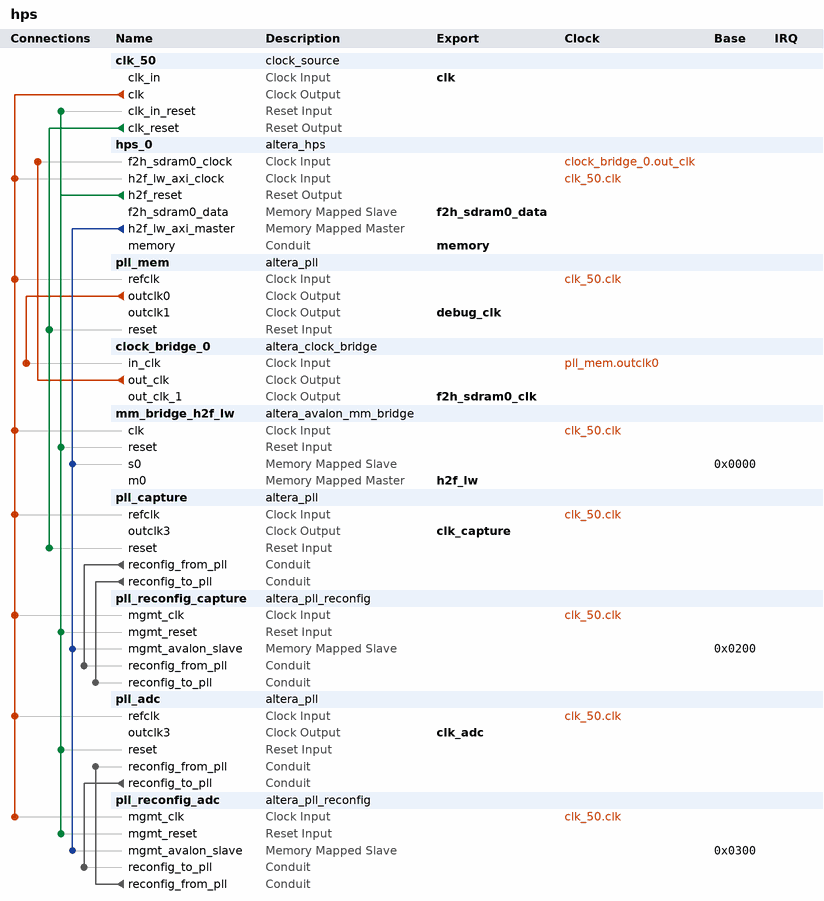
[diagram p0: system contents]
# Platform Designer (Qsys) system hps, Cyclone V 5CSEBA6U23I7
# Parameters at their usual value, and those the tool derives, are not listed.
package require -exact qsys 18.0
create_system hps
set_project_property DEVICE_FAMILY {Cyclone V}
set_project_property DEVICE 5CSEBA6U23I7

add_instance clk_50 clock_source 18.0
set_instance_parameter_value clk_50 clockFrequency 50000000

add_instance hps_0 altera_hps 18.0
set_instance_parameter_value hps_0 EMAC1_Mode N/A
set_instance_parameter_value hps_0 EMAC1_PinMuxing Unused
set_instance_parameter_value hps_0 F2SCLK_COLDRST_Enable false
set_instance_parameter_value hps_0 F2SCLK_DBGRST_Enable false
set_instance_parameter_value hps_0 F2SCLK_WARMRST_Enable false
set_instance_parameter_value hps_0 F2SDRAM_Type {Avalon-MM Bidirectional}
set_instance_parameter_value hps_0 F2SDRAM_Width 256
set_instance_parameter_value hps_0 F2SINTERRUPT_Enable false
set_instance_parameter_value hps_0 F2S_Width 0
set_instance_parameter_value hps_0 FPGA_PERIPHERAL_OUTPUT_CLOCK_FREQ_EMAC0_GTX_CLK 125
set_instance_parameter_value hps_0 FPGA_PERIPHERAL_OUTPUT_CLOCK_FREQ_EMAC0_MD_CLK 2.5
set_instance_parameter_value hps_0 FPGA_PERIPHERAL_OUTPUT_CLOCK_FREQ_EMAC1_GTX_CLK 125
set_instance_parameter_value hps_0 FPGA_PERIPHERAL_OUTPUT_CLOCK_FREQ_EMAC1_MD_CLK 2.5
set_instance_parameter_value hps_0 HPS_PROTOCOL DDR3
set_instance_parameter_value hps_0 I2C0_Mode N/A
set_instance_parameter_value hps_0 I2C0_PinMuxing Unused
set_instance_parameter_value hps_0 I2C1_Mode N/A
set_instance_parameter_value hps_0 I2C1_PinMuxing Unused
set_instance_parameter_value hps_0 LWH2F_Enable true
set_instance_parameter_value hps_0 MEM_BANKADDR_WIDTH 3
set_instance_parameter_value hps_0 MEM_CLK_FREQ 400.0
set_instance_parameter_value hps_0 MEM_COL_ADDR_WIDTH 10
set_instance_parameter_value hps_0 MEM_DQ_WIDTH 32
set_instance_parameter_value hps_0 MEM_DRV_STR RZQ/6
set_instance_parameter_value hps_0 MEM_ROW_ADDR_WIDTH 15
set_instance_parameter_value hps_0 MEM_RTT_NOM RZQ/6
set_instance_parameter_value hps_0 MEM_RTT_WR {Dynamic ODT off}
set_instance_parameter_value hps_0 MEM_TCL 7
set_instance_parameter_value hps_0 MEM_TFAW_NS 37.5
set_instance_parameter_value hps_0 MEM_TRAS_NS 35.0
set_instance_parameter_value hps_0 MEM_TRCD_NS 13.75
set_instance_parameter_value hps_0 MEM_TRFC_NS 300.0
set_instance_parameter_value hps_0 MEM_TRP_NS 13.75
set_instance_parameter_value hps_0 MEM_VENDOR Other
set_instance_parameter_value hps_0 MEM_WTCL 7
set_instance_parameter_value hps_0 QSPI_Mode N/A
set_instance_parameter_value hps_0 QSPI_PinMuxing Unused
set_instance_parameter_value hps_0 REF_CLK_FREQ 25.0
set_instance_parameter_value hps_0 S2FCLK_USER2CLK 5
set_instance_parameter_value hps_0 S2F_Width 0
set_instance_parameter_value hps_0 SDIO_Mode N/A
set_instance_parameter_value hps_0 SDIO_PinMuxing Unused
set_instance_parameter_value hps_0 SPIM1_Mode N/A
set_instance_parameter_value hps_0 SPIM1_PinMuxing Unused
set_instance_parameter_value hps_0 STM_Enable false
set_instance_parameter_value hps_0 TIMING_BOARD_AC_SKEW 0.02
set_instance_parameter_value hps_0 TIMING_BOARD_AC_TO_CK_SKEW 0.0
set_instance_parameter_value hps_0 TIMING_BOARD_DQ_TO_DQS_SKEW 0.0
set_instance_parameter_value hps_0 TIMING_BOARD_MAX_CK_DELAY 0.6
set_instance_parameter_value hps_0 TIMING_BOARD_MAX_DQS_DELAY 0.6
set_instance_parameter_value hps_0 TIMING_BOARD_SKEW_BETWEEN_DQS 0.02
set_instance_parameter_value hps_0 TIMING_BOARD_SKEW_CKDQS_DIMM_MAX 0.01
set_instance_parameter_value hps_0 TIMING_BOARD_SKEW_CKDQS_DIMM_MIN -0.01
set_instance_parameter_value hps_0 TIMING_BOARD_SKEW_WITHIN_DQS 0.02
set_instance_parameter_value hps_0 TIMING_TDH 125
set_instance_parameter_value hps_0 TIMING_TDQSCK 400
set_instance_parameter_value hps_0 TIMING_TDQSQ 120
set_instance_parameter_value hps_0 TIMING_TDS 50
set_instance_parameter_value hps_0 TIMING_TIH 250
set_instance_parameter_value hps_0 TIMING_TIS 175
set_instance_parameter_value hps_0 TIMING_TQSH 0.38
set_instance_parameter_value hps_0 UART0_Mode N/A
set_instance_parameter_value hps_0 UART0_PinMuxing Unused
set_instance_parameter_value hps_0 USB1_Mode N/A
set_instance_parameter_value hps_0 USB1_PinMuxing Unused
set_instance_parameter_value hps_0 desired_cfg_clk_mhz 100.0
set_instance_parameter_value hps_0 desired_qspi_clk_mhz 400.0

add_instance pll_mem altera_pll 18.0
set_instance_parameter_value pll_mem gui_device_speed_grade 1
set_instance_parameter_value pll_mem gui_number_of_clocks 2
set_instance_parameter_value pll_mem gui_operation_mode direct
set_instance_parameter_value pll_mem gui_output_clock_frequency0 100.0
set_instance_parameter_value pll_mem gui_output_clock_frequency1 200.0
set_instance_parameter_value pll_mem gui_pll_mode {Integer-N PLL}
set_instance_parameter_value pll_mem gui_reference_clock_frequency 50.0
set_instance_parameter_value pll_mem gui_use_locked false

add_instance clock_bridge_0 altera_clock_bridge 18.0
set_instance_parameter_value clock_bridge_0 DERIVED_CLOCK_RATE 100000000
set_instance_parameter_value clock_bridge_0 EXPLICIT_CLOCK_RATE 0
set_instance_parameter_value clock_bridge_0 NUM_CLOCK_OUTPUTS 2

add_instance mm_bridge_h2f_lw altera_avalon_mm_bridge 18.0
set_instance_parameter_value mm_bridge_h2f_lw ADDRESS_UNITS WORDS
set_instance_parameter_value mm_bridge_h2f_lw ADDRESS_WIDTH 6
set_instance_parameter_value mm_bridge_h2f_lw DATA_WIDTH 32
set_instance_parameter_value mm_bridge_h2f_lw MAX_PENDING_RESPONSES 1
set_instance_parameter_value mm_bridge_h2f_lw PIPELINE_COMMAND 0
set_instance_parameter_value mm_bridge_h2f_lw PIPELINE_RESPONSE 0
set_instance_parameter_value mm_bridge_h2f_lw USE_AUTO_ADDRESS_WIDTH 0

add_instance pll_capture altera_pll 18.0
set_instance_parameter_value pll_capture gui_actual_output_clock_frequency0 {500.000000 MHz}
set_instance_parameter_value pll_capture gui_device_speed_grade 1
set_instance_parameter_value pll_capture gui_en_adv_params true
set_instance_parameter_value pll_capture gui_en_reconf true
set_instance_parameter_value pll_capture gui_number_of_clocks 4
set_instance_parameter_value pll_capture gui_operation_mode direct
set_instance_parameter_value pll_capture gui_output_clock_frequency0 500.0
set_instance_parameter_value pll_capture gui_output_clock_frequency1 62.5
set_instance_parameter_value pll_capture gui_output_clock_frequency2 100.0
set_instance_parameter_value pll_capture gui_output_clock_frequency3 100.0
set_instance_parameter_value pll_capture gui_phout_division 4
set_instance_parameter_value pll_capture gui_pll_mode {Integer-N PLL}
set_instance_parameter_value pll_capture gui_reference_clock_frequency 50.0
set_instance_parameter_value pll_capture gui_use_locked false

add_instance pll_reconfig_capture altera_pll_reconfig 18.0

add_instance pll_adc altera_pll 18.0
set_instance_parameter_value pll_adc gui_device_speed_grade 1
set_instance_parameter_value pll_adc gui_en_adv_params true
set_instance_parameter_value pll_adc gui_en_reconf true
set_instance_parameter_value pll_adc gui_number_of_clocks 4
set_instance_parameter_value pll_adc gui_operation_mode direct
set_instance_parameter_value pll_adc gui_output_clock_frequency0 40.0001
set_instance_parameter_value pll_adc gui_output_clock_frequency1 100.0
set_instance_parameter_value pll_adc gui_output_clock_frequency2 100.0
set_instance_parameter_value pll_adc gui_output_clock_frequency3 100.0
set_instance_parameter_value pll_adc gui_pll_mode {Integer-N PLL}
set_instance_parameter_value pll_adc gui_reference_clock_frequency 50.0
set_instance_parameter_value pll_adc gui_use_locked false

add_instance pll_reconfig_adc altera_pll_reconfig 18.0

# connections
add_connection clk_50.clk hps_0.h2f_lw_axi_clock clock
add_connection clk_50.clk mm_bridge_h2f_lw.clk clock
add_connection clk_50.clk pll_adc.refclk clock
add_connection clk_50.clk pll_capture.refclk clock
add_connection clk_50.clk pll_mem.refclk clock
add_connection clk_50.clk pll_reconfig_adc.mgmt_clk clock
add_connection clk_50.clk pll_reconfig_capture.mgmt_clk clock
add_connection clock_bridge_0.out_clk hps_0.f2h_sdram0_clock clock
add_connection pll_mem.outclk0 clock_bridge_0.in_clk clock
add_connection clk_50.clk_reset pll_capture.reset reset
add_connection clk_50.clk_reset pll_mem.reset reset
add_connection hps_0.h2f_reset clk_50.clk_in_reset reset
add_connection hps_0.h2f_reset mm_bridge_h2f_lw.reset reset
add_connection hps_0.h2f_reset pll_adc.reset reset
add_connection hps_0.h2f_reset pll_reconfig_adc.mgmt_reset reset
add_connection hps_0.h2f_reset pll_reconfig_capture.mgmt_reset reset
add_connection hps_0.h2f_lw_axi_master mm_bridge_h2f_lw.s0 avalon
set_connection_parameter_value hps_0.h2f_lw_axi_master/mm_bridge_h2f_lw.s0 baseAddress 0x0000
add_connection hps_0.h2f_lw_axi_master pll_reconfig_adc.mgmt_avalon_slave avalon
set_connection_parameter_value hps_0.h2f_lw_axi_master/pll_reconfig_adc.mgmt_avalon_slave baseAddress 0x0300
add_connection hps_0.h2f_lw_axi_master pll_reconfig_capture.mgmt_avalon_slave avalon
set_connection_parameter_value hps_0.h2f_lw_axi_master/pll_reconfig_capture.mgmt_avalon_slave baseAddress 0x0200
add_connection pll_adc.reconfig_to_pll pll_reconfig_adc.reconfig_to_pll conduit
add_connection pll_capture.reconfig_from_pll pll_reconfig_capture.reconfig_from_pll conduit
add_connection pll_capture.reconfig_to_pll pll_reconfig_capture.reconfig_to_pll conduit
add_connection pll_reconfig_adc.reconfig_from_pll pll_adc.reconfig_from_pll conduit

# exported interfaces
add_interface clk clock sink
set_interface_property clk EXPORT_OF clk_50.clk_in
add_interface clk_adc clock source
set_interface_property clk_adc EXPORT_OF pll_adc.outclk3
add_interface clk_capture clock source
set_interface_property clk_capture EXPORT_OF pll_capture.outclk3
add_interface debug_clk clock source
set_interface_property debug_clk EXPORT_OF pll_mem.outclk1
add_interface f2h_sdram0_clk clock source
set_interface_property f2h_sdram0_clk EXPORT_OF clock_bridge_0.out_clk_1
add_interface f2h_sdram0_data avalon slave
set_interface_property f2h_sdram0_data EXPORT_OF hps_0.f2h_sdram0_data
add_interface h2f_lw avalon master
set_interface_property h2f_lw EXPORT_OF mm_bridge_h2f_lw.m0
add_interface memory conduit end
set_interface_property memory EXPORT_OF hps_0.memory

set_interconnect_requirement {$system} qsys_mm.clockCrossingAdapter HANDSHAKE
set_interconnect_requirement {$system} qsys_mm.enableEccProtection FALSE
set_interconnect_requirement {$system} qsys_mm.insertDefaultSlave FALSE
set_interconnect_requirement {$system} qsys_mm.maxAdditionalLatency 1

save_system hps.qsys
